# EAGLE design rgbw (EAGLE 6.6.0)
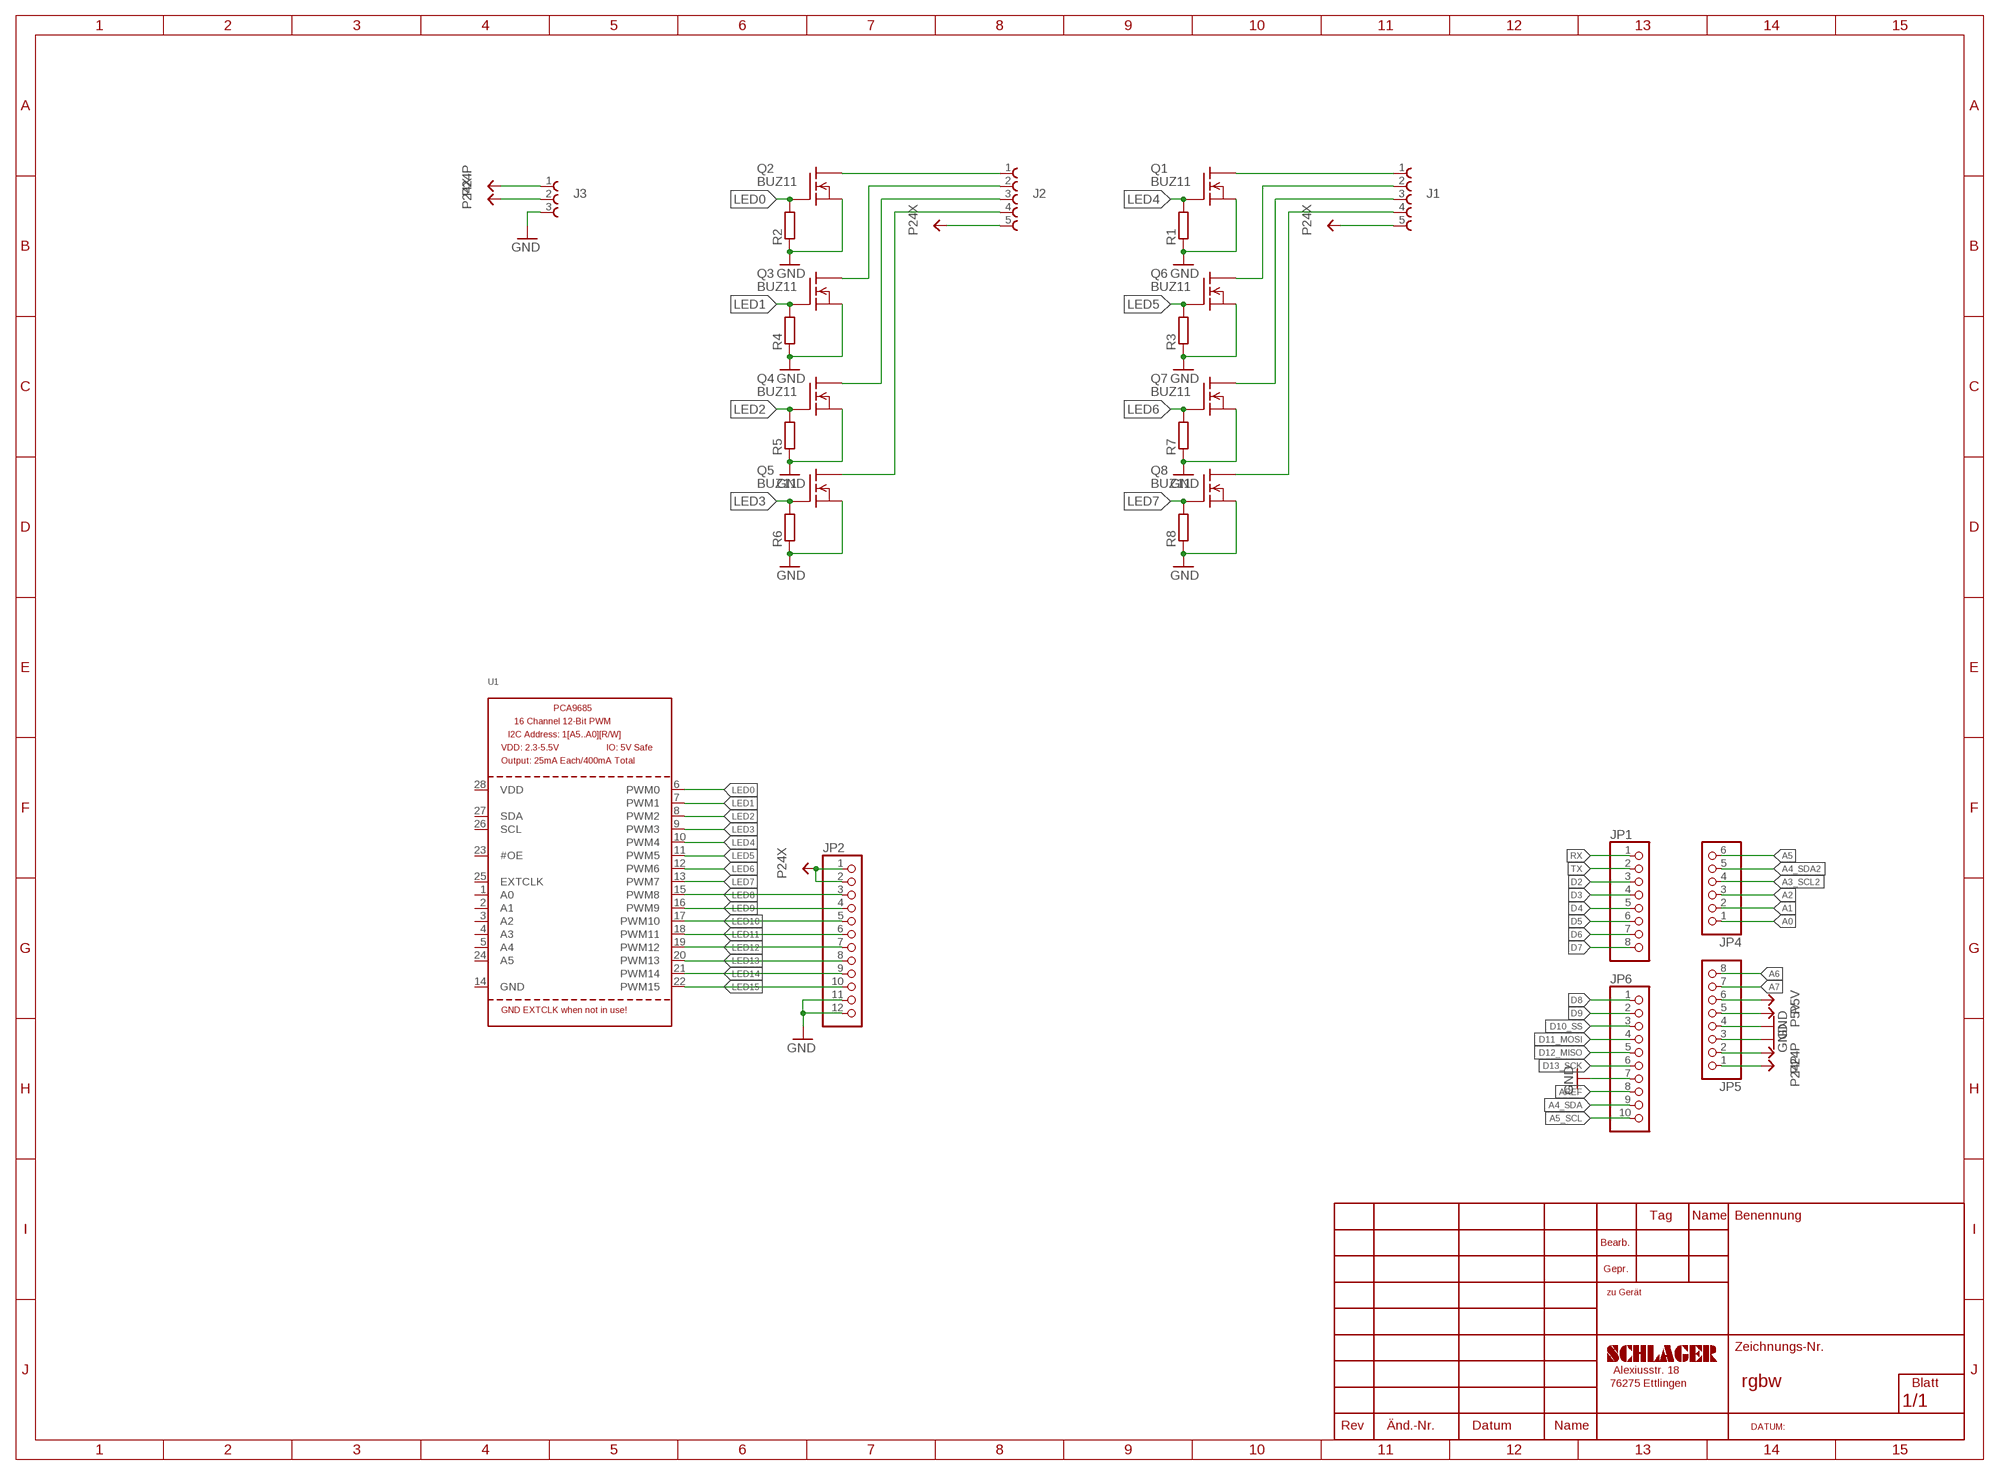
[diagram p0: schematic, sheet 1]

## Parts
J1  691322310005  [691322310005]
J2  691322310005  [691322310005]
J3  691313510003  [691313510003]
JP1  PINHD-1X8  [1X08]
JP2  PINHD-1X12  [1X12]
JP4  PINHD-1X6  [1X06]
JP5  PINHD-1X8  [1X08]
JP6  PINHD-1X10  [1X10]
Q1  BUZ11  [TO220V]
Q2  BUZ11  [TO220V]
Q3  BUZ11  [TO220V]
Q4  BUZ11  [TO220V]
Q5  BUZ11  [TO220V]
Q6  BUZ11  [TO220V]
Q7  BUZ11  [TO220V]
Q8  BUZ11  [TO220V]
R1  R-EU_R0805  [R0805]
R2  R-EU_R0805  [R0805]
R3  R-EU_R0805  [R0805]
R4  R-EU_R0805  [R0805]
R5  R-EU_R0805  [R0805]
R6  R-EU_R0805  [R0805]
R7  R-EU_R0805  [R0805]
R8  R-EU_R0805  [R0805]
U1  PCA9685  [TSSOP28]

## Nets
A0: JP4.1
A1: JP4.2
A2: JP4.3
A3_SCL2: JP4.4
A4_SDA: JP6.9
A4_SDA2: JP4.5
A5: JP4.6
A5_SCL: JP6.10
A6: JP5.8
A7: JP5.7
AREF: JP6.8
D2: JP1.3
D3: JP1.4
D4: JP1.5
D5: JP1.6
D6: JP1.7
D7: JP1.8
D8: JP6.1
D9: JP6.2
D10_SS: JP6.3
D11_MOSI: JP6.4
D12_MISO: JP6.5
D13_SCK: JP6.6
GND: J3.3 JP2.11 JP2.12 JP5.3 JP5.4 JP6.7 Q1.3(S) Q2.3(S) Q3.3(S) Q4.3(S) Q5.3(S) Q6.3(S) Q7.3(S) Q8.3(S) R1.1 R2.1 R3.1 R4.1 R5.1 R6.1 R7.1 R8.1
LED0: Q2.1(G) R2.2 U1.6(PWM0)
LED1: Q3.1(G) R4.2 U1.7(PWM1)
LED2: Q4.1(G) R5.2 U1.8(PWM2)
LED3: Q5.1(G) R6.2 U1.9(PWM3)
LED4: Q1.1(G) R1.2 U1.10(PWM4)
LED5: Q6.1(G) R3.2 U1.11(PWM5)
LED6: Q7.1(G) R7.2 U1.12(PWM6)
LED7: Q8.1(G) R8.2 U1.13(PWM7)
LED8: JP2.3 U1.15(PWM8)
LED9: JP2.4 U1.16(PWM9)
LED10: JP2.5 U1.17(PWM10)
LED11: JP2.6 U1.18(PWM11)
LED12: JP2.7 U1.19(PWM12)
LED13: JP2.8 U1.20(PWM13)
LED14: JP2.9 U1.21(PWM14)
LED15: JP2.10 U1.22(PWM15)
N$2: J2.1 Q2.2(D)
N$3: J2.2 Q3.2(D)
N$4: J1.3 Q7.2(D)
N$5: J2.3 Q4.2(D)
N$6: J2.4 Q5.2(D)
N$7: J1.4 Q8.2(D)
N$8: J1.1 Q1.2(D)
N$9: J1.2 Q6.2(D)
P5V: JP5.5 JP5.6
P24P: J3.1 JP5.1 JP5.2
P24X: J1.5 J2.5 J3.2 JP2.1 JP2.2
RX: JP1.1
TX: JP1.2
Unconnected: U1.1(A0) U1.2(A1) U1.3(A2) U1.4(A3) U1.5(A4) U1.23(#OE) U1.24(A5) U1.25(EXTCLK) U1.26(SCL) U1.27(SDA)

## Power pins joined to a net without a drawn wire
GND: U1.14(GND)
VDD: U1.28(VDD)

## Library data of the parts
J1 J2 = Eagle_TERMINAL_BLOCKS_rev16a:691322310005: WR-TBL Serie 322 - 3.81mm Vertical PCB Header , 5 Pins=>Code : Con_TBL_Pluggable_3.81_PCB_THT_Simple_691322310005 <http://katalog.we-online.de/media/images/eican/Con_TBL_Pluggable_3.81_PCB_THT_Simple_6913223100xx_pf2.jpg> Details see: http://katalog.we-online.de/en/em/691_322_310_0xx Created 2014-06-19, Karrer Zheng 2014 (C) Würth Elektronik
J3 = Eagle_TERMINAL_BLOCKS_rev16a:691313510003: WR-TBL Serie 313 - 5.08 mm Close Horizontal PCB Header , 3 Pins=>Code : Con_TBL_Pluggable_5.08_PCB_THT_Simple_H_691313510003 <http://katalog.we-online.de/media/images/eican/Con_TBL_Pluggable_5.08_PCB_THT_Simple_H_6913135100xx_pf2.jpg> Details see: http://katalog.we-online.de/en/em/691_313_510_0xx Created 2014-06-25, Karrer Zheng 2014 (C) Würth Elektronik
JP1 JP5 = pinhead:PINHD-1X8: PIN HEADER
JP2 = pinhead:PINHD-1X12: PIN HEADER
JP4 = pinhead:PINHD-1X6: PIN HEADER
JP6 = pinhead:PINHD-1X10: PIN HEADER
Q1-Q8 = transistor-fet:BUZ11: N-Channel Enhancement MOSFET 50V; 30A; 0,040Ohm
R1-R8 = schlager_passiv:R-EU_: RESISTOR, European symbol
U1 = adafruit:PCA9685: PCA9685 - 16 Channel 12-Bit I2C PWM Controller 5.0V tolerant 16 channel, 12-bit I2C PWM controller with 25mA per output (max. 400mA total) Digikey: 568-5931-1-ND

## Net classes
4 USBpair: width 0.254 mm, drill 0.406 mm, clearance 0.508 mm

## Board
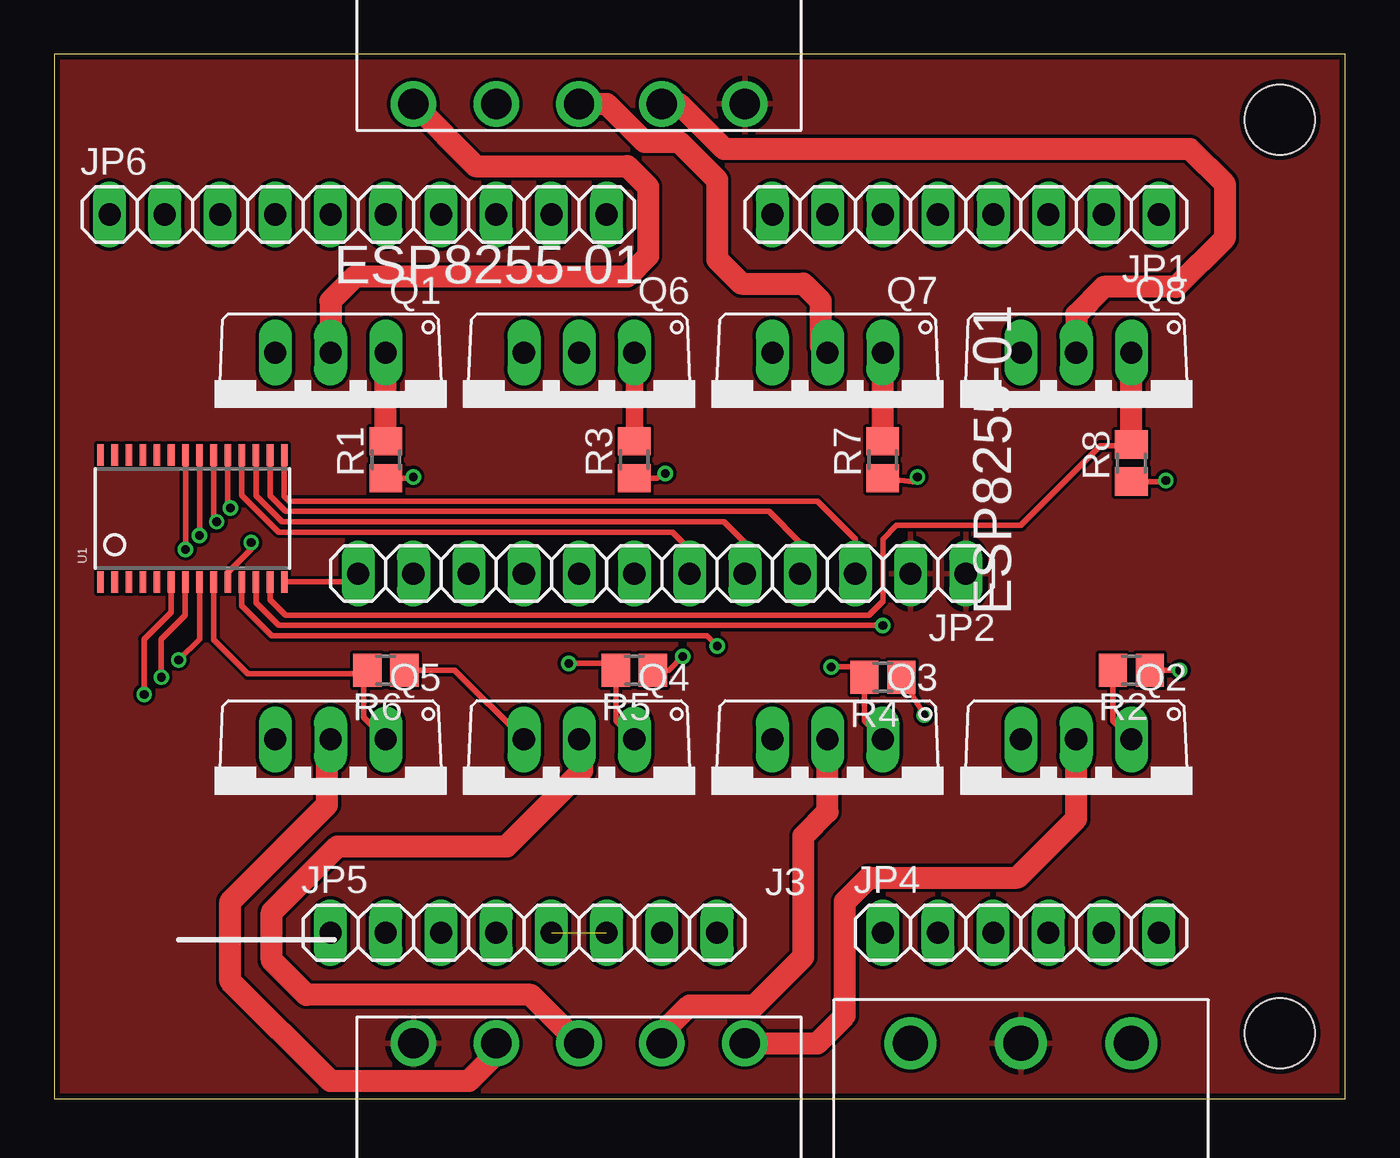
[diagram p1: board, top side]
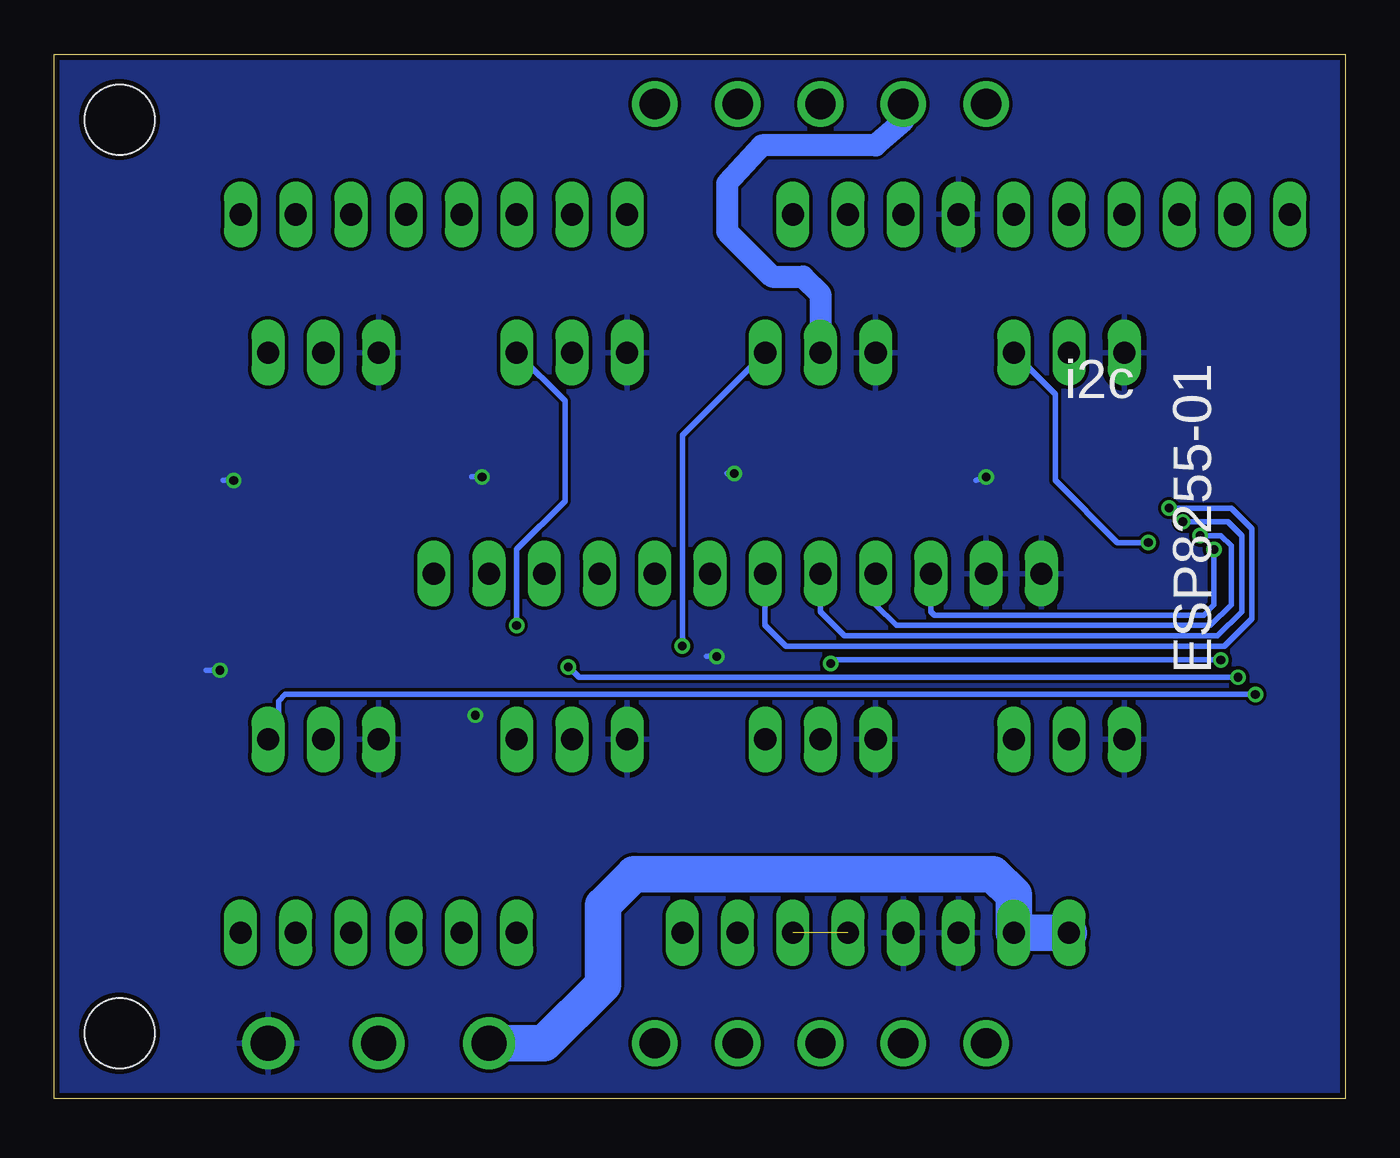
[diagram p2: board, bottom side, seen from below]

Size 59.36 x 48 mm. Coordinates in mm from the lower left corner, seen from the top.
Outline: 0,0 59.36,0 59.36,48 0,48 0,0
Copper layers (1*16): Top 0.035mm / dielectric 1.5mm / Bottom 0.035mm
Design rules "ITEADstudio_DRC": minimum track width 6mil, minimum drill 12mil, track to track 6mil, track to pad 6mil, pad to pad 6mil, via to via 6mil, smd to smd 0mil, copper to edge 10mil, drill to drill 10mil, minimum pad ring 10mil, minimum via ring 6mil, stop-mask expansion 2mil, vias tented up to drill 100mil, thermal gap 10mil
Holes 3.2 mm at 56.36,45 56.36,3

### Footprints (pad centres in the part's own frame; a part is rotated, then mirrored left to right if it is on the bottom)
691322310005 = drill 1.4: 1 -3.81,0; 2 0,0; 3 3.81,0; 4 7.62,0; 5 11.43,0
691313510003 = drill 1.6: 1 -5.08,0; 2 0,0; 3 5.08,0
1X08 = drill 1.016 long: 1 -8.89,0; 2 -6.35,0; 3 -3.81,0; 4 -1.27,0; 5 1.27,0; 6 3.81,0; 7 6.35,0; 8 8.89,0
1X12 = drill 1.016 long: 1 -13.97,0; 2 -11.43,0; 3 -8.89,0; 4 -6.35,0; 5 -3.81,0; 6 -1.27,0; 7 1.27,0; 8 3.81,0; 9 6.35,0; 10 8.89,0; 11 11.43,0; 12 13.97,0
1X06 = drill 1.016 long: 1 -6.35,0; 2 -3.81,0; 3 -1.27,0; 4 1.27,0; 5 3.81,0; 6 6.35,0
1X10 = drill 1.016 long: 1 -11.43,0; 2 -8.89,0; 3 -6.35,0; 4 -3.81,0; 5 -1.27,0; 6 1.27,0; 7 3.81,0; 8 6.35,0; 9 8.89,0; 10 11.43,0
TO220V = drill 1.016 long: 1 -2.54,-2.54; 2 0,-2.54; 3 2.54,-2.54
R0805 = smd 1.3 x 1.5: 1 -0.85,0; 2 0.85,0
TSSOP28 = smd 0.305 x 0.991: 1 -4.225,-2.918; 2 -3.575,-2.918; 3 -2.925,-2.918; 4 -2.275,-2.918; 5 -1.625,-2.918; 6 -0.975,-2.918; 7 -0.325,-2.918; 8 0.325,-2.918; 9 0.975,-2.918; 10 1.625,-2.918; 11 2.275,-2.918; 12 2.925,-2.918; 13 3.575,-2.918; 14 4.225,-2.918; 15 4.225,2.918; 16 3.575,2.918; 17 2.925,2.918; 18 2.275,2.918; 19 1.625,2.918; 20 0.975,2.918; 21 0.325,2.918; 22 -0.325,2.918; 23 -0.975,2.918; 24 -1.625,2.918; 25 -2.275,2.918; 26 -2.925,2.918; 27 -3.575,2.918; 28 -4.225,2.918

### Placement (x,y rotation side)
J1  20.32,45.72 0 top
J2  27.94,2.54 180 top
J3  44.45,2.54 0 top
JP1  41.91,40.64 180 top
JP2  27.94,24.13 180 top
JP4  44.45,7.62 0 top
JP5  21.59,7.62 0 top
JP6  13.97,40.64 0 top
Q1  12.7,31.75 180 top
Q2  46.99,13.97 180 top
Q3  35.56,13.97 180 top
Q4  24.13,13.97 180 top
Q5  12.7,13.97 180 top
Q6  24.13,31.75 180 top
Q7  35.56,31.75 180 top
Q8  46.99,31.75 180 top
R1  15.24,29.37 90 top
R2  49.53,19.68 180 top
R3  26.67,29.37 90 top
R4  38.1,19.37 180 top
R5  26.67,19.68 180 top
R6  15.24,19.68 180 top
R7  38.1,29.37 90 top
R8  49.53,29.21 90 top
U1  6.35,26.67 0 top

### Tracks (layer width: path | path; a pad name or v marks a point on that pad's centre or on a via)
GND  (via drill 0.4)
  Top 0.254: U1.14 13.59,23.75 JP2.12 | R1.1 16.45,28.52 v16.51,28.57 | R3.1 27.73,28.52 v28.1,28.73 | R7.1 39.47,28.36 v39.69,28.57 | R4.1 v40.01,17.62 | R2.1 v51.75,19.68 | R5.1 28.26,19.68 v28.89,20.32 | R6.1 18.41,19.68 Q4.3 | R8.1 51.06,28.36 v51.12,28.42
  Bottom 0.254: v16.51,28.57 16.99,28.42 | v28.1,28.73 28.42,28.73 | v39.69,28.57 40.16,28.57 | v51.75,19.68 52.39,19.68 | v28.89,20.32 29.37,20.32 | v51.12,28.42 51.59,28.42
  pour Bottom: -49.53,72.39 80.01,72.39 80.01,-13.97 -49.53,-13.97
LED0  (via drill 0.4)
  Top 0.254: U1.6 5.38,22.36 4.13,21.11 v4.13,18.57 | R2.2 48.68,17.36 Q2.1
  Bottom 0.254: v4.13,18.57 48.74,18.57 49.05,18.26 49.05,16.99 Q2.1
LED1  (via drill 0.4)
  Top 0.254: Q3.1 37.25,17.36 R4.2 37.09,19.84 v35.72,19.84 | U1.7 6.03,22.22 4.92,21.11 v4.92,19.37
  Bottom 0.254: v4.92,19.37 35.24,19.37 v35.72,19.84
LED2  (via drill 0.4)
  Top 0.254: U1.8 6.67,21.12 v5.71,20.16 | v23.65,20 25.5,20 R5.2 25.82,17.36 Q4.1
  Bottom 0.254: v5.71,20.16 23.5,20.16 v23.65,20
LED3
  Top 0.254: U1.9 7.33,21.09 8.89,19.53 14.23,19.53 | 14.23,19.53 R6.2 | 14.23,19.53 14.23,17.52 Q5.1
LED4  (via drill 0.4)
  Top 0.254: v9.05,25.56 9.05,25.24 7.97,24.17 U1.10
  Top 1.016: R1.2 Q1.1
  Bottom 0.254: v9.05,25.56 10.48,25.56 13.34,28.42 13.34,32.38 Q1.1
LED5  (via drill 0.4)
  Top 0.254: U1.11 8.62,22.65 10,21.27 30,21.27 v30.48,20.8
  Top 0.813: R3.2 Q6.1
  Bottom 0.254: v30.48,20.8 30.48,30.48 Q6.1
LED6  (via drill 0.4)
  Top 0.254: U1.12 9.28,22.79 10.32,21.75 v38.1,21.75
  Top 1.016: R7.2 Q7.1
  Bottom 0.254: v38.1,21.75 38.1,25.24 35.88,27.46 35.88,32.07 Q7.1
LED7
  Top 0.254: U1.13 9.93,22.94 10.64,22.23 37.47,22.23 38.1,22.86 38.1,25.72 38.73,26.35 44.45,26.35 48.1,30 49.47,30 R8.2
  Top 1.016: R8.2 Q8.1
LED8
  Top 0.254: JP2.3 36.83,25.72 35.08,27.46 10.79,27.46 10.57,27.68 U1.15
LED9
  Top 0.254: JP2.4 34.29,25.56 32.86,26.99 10.64,26.99 9.93,27.7 U1.16
LED10
  Top 0.254: JP2.5 31.75,25.56 30.8,26.51 10.48,26.51 9.28,27.71 U1.17
LED11
  Top 0.254: JP2.6 29.21,25.24 28.42,26.04 10.32,26.04 8.62,27.73 U1.18
LED12  (via drill 0.4)
  Top 0.254: U1.19 7.97,27.43 v8.1,27.15
  Bottom 0.254: v8.1,27.15 5.24,27.15 4.29,26.19 4.29,22.07 5.56,20.8 25.72,20.8 26.67,21.75 JP2.7
LED13  (via drill 0.4)
  Top 0.254: U1.20 7.33,26.81 v7.46,26.51
  Bottom 0.254: JP2.8 24.13,22.38 23.02,21.27 5.87,21.27 4.76,22.38 4.76,25.88 5.4,26.51 v7.46,26.51
LED14  (via drill 0.4)
  Top 0.254: U1.21 6.67,26.19 v6.67,25.88
  Bottom 0.254: JP2.9 21.59,22.7 20.64,21.75 6.19,21.75 5.24,22.7 5.24,25.4 5.71,25.88 v6.67,25.88
LED15  (via drill 0.4)
  Top 0.254: v6.03,25.24 6.03,29.58 U1.22
  Bottom 0.254: JP2.10 19.05,22.38 18.89,22.23 6.51,22.23 6.03,22.7 v6.03,25.24
N$2
  Top 1.016: J2.1 35.08,2.54 36.35,3.81 36.35,9.05 37.47,10.16 44.29,10.16 46.99,12.86 Q2.2
N$3
  Top 1.016: J2.2 27.94,3.02 29.21,4.29 32.23,4.29 34.45,6.51 34.45,12.06 35.56,13.18 Q3.2
N$4
  Top 1.016: J1.3 25.4,45.72 27.15,43.97 28.73,43.97 30.48,42.23 30.48,38.58 31.59,37.47 34.45,37.47 35.24,36.67 35.24,34.61 Q7.2
N$5
  Top 1.016: J2.3 21.91,4.76 11.59,4.76 10,6.35 10,8.57 13.02,11.59 20.8,11.59 24.29,15.08 24.29,16.35 Q4.2
N$6
  Top 1.016: Q5.2 12.54,16.35 12.54,13.49 8.1,9.05 8.1,5.4 12.7,0.79 19.05,0.79 20.32,2.06 J2.4
N$7
  Top 1.016: J1.4 28.73,45.72 30.8,43.66 52.23,43.66 53.82,42.07 53.82,39.53 51.59,37.31 48.26,37.31 46.99,36.04 Q8.2
N$8
  Top 1.016: J1.1 19.37,42.86 26.35,42.86 27.3,41.91 27.3,38.73 26.35,37.78 13.81,37.78 12.7,36.67 Q1.2
N$9
  Bottom 1.016: J1.2 20.32,44.93 21.59,43.81 26.83,43.81 28.42,42.07 28.42,39.85 26.35,37.78 24.92,37.78 24.13,36.99 Q6.2
P5V  (1 unrouted)
P24P
  Bottom 1.676: J3.1 36.83,2.54 34.13,5.24 34.13,8.89 32.7,10.32 16.19,10.32 15.24,9.37 JP5.2 JP5.1
P24X
  pour Top (rank 5): -1.75,69.85 68.58,68.58 68.58,-13.97 -2.06,-13.81 -2.06,24.29 -1.75,25.4

### Text on the board
tNames: ESP8255-01 | ESP8255-01
bNames: ESP8255-01 | i2c